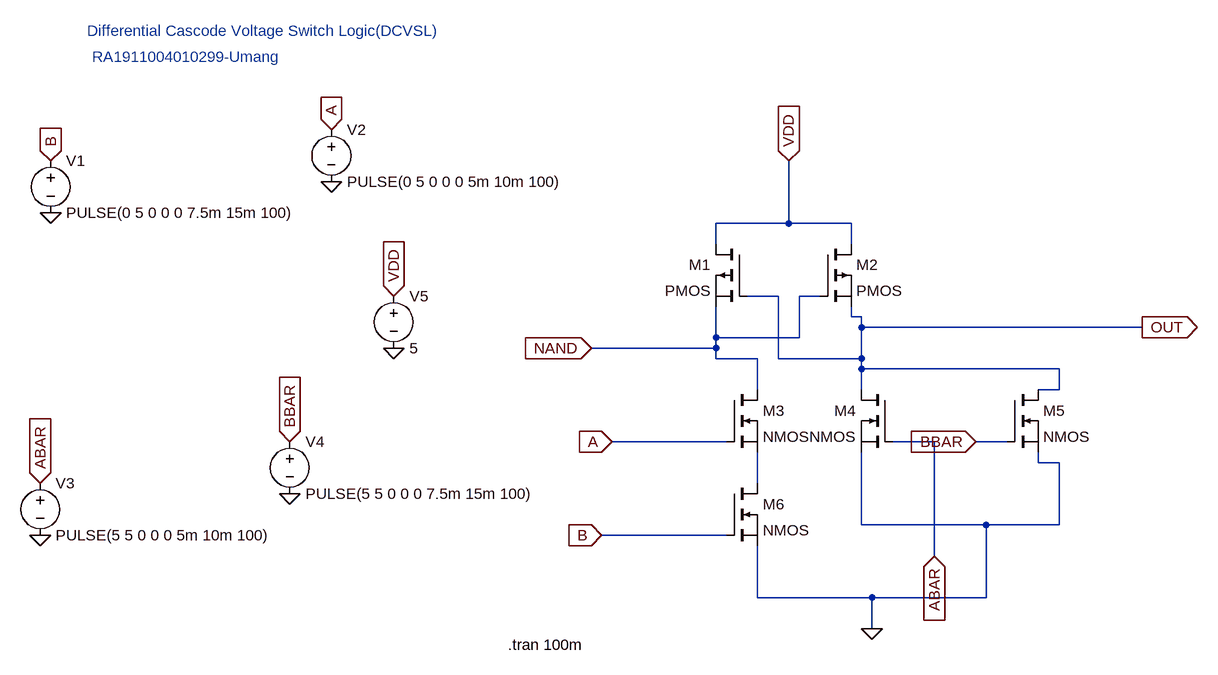
[diagram p0: schematic dcvsl.asc]
dcvsl.asc, the LTspice schematic file:
Version 4
SHEET 1 880 680
WIRE 176 -64 176 -160
WIRE 176 -64 64 -64
WIRE 272 -64 176 -64
WIRE 64 -32 64 -64
WIRE 272 -32 272 -64
WIRE 160 48 112 48
WIRE 224 48 192 48
WIRE 272 80 272 64
WIRE 288 80 272 80
WIRE 288 96 288 80
WIRE 720 96 288 96
WIRE 64 112 64 64
WIRE 192 112 192 48
WIRE 192 112 64 112
WIRE 64 128 64 112
WIRE 64 128 -128 128
WIRE 64 144 64 128
WIRE 128 144 64 144
WIRE 160 144 160 48
WIRE 288 144 288 96
WIRE 288 144 160 144
WIRE 288 160 288 144
WIRE 592 160 288 160
WIRE 128 192 128 144
WIRE 288 192 288 160
WIRE 592 192 592 160
WIRE 592 192 560 192
WIRE 80 272 -96 272
WIRE 400 272 336 272
WIRE 512 272 464 272
WIRE 560 304 560 288
WIRE 592 304 560 304
WIRE 128 336 128 288
WIRE 288 400 288 288
WIRE 480 400 288 400
WIRE 592 400 592 304
WIRE 592 400 480 400
WIRE 80 416 -112 416
WIRE 400 448 400 272
WIRE 128 512 128 432
WIRE 304 512 128 512
WIRE 480 512 480 400
WIRE 480 512 304 512
WIRE 304 560 304 512
FLAG 400 448 ABAR
IOPIN 400 448 In
FLAG 464 272 BBAR
IOPIN 464 272 In
FLAG 720 96 OUT
IOPIN 720 96 Out
FLAG 176 -160 VDD
IOPIN 176 -160 In
FLAG -128 128 NAND
IOPIN -128 128 In
FLAG -96 272 A
IOPIN -96 272 In
FLAG -112 416 B
IOPIN -112 416 In
FLAG 304 560 0
FLAG -960 -160 B
IOPIN -960 -160 In
FLAG -528 -208 A
IOPIN -528 -208 In
FLAG -432 48 VDD
IOPIN -432 48 In
FLAG -592 272 BBAR
IOPIN -592 272 In
FLAG -976 336 ABAR
IOPIN -976 336 In
FLAG -960 -80 0
FLAG -528 -128 0
FLAG -432 128 0
FLAG -592 352 0
FLAG -976 416 0
SYMBOL pmos 112 -32 M0
SYMATTR InstName M1
SYMBOL pmos 224 -32 R0
SYMATTR InstName M2
SYMBOL nmos 80 192 R0
SYMATTR InstName M3
SYMBOL nmos 336 192 M0
SYMATTR InstName M4
SYMBOL nmos 512 192 R0
SYMATTR InstName M5
SYMBOL nmos 80 336 R0
SYMATTR InstName M6
SYMBOL voltage -960 -176 R0
WINDOW 123 0 0 Left 0
WINDOW 39 0 0 Left 0
SYMATTR InstName V1
SYMATTR Value PULSE(0 5 0 0 0 7.5m 15m 100)
SYMBOL voltage -528 -224 R0
WINDOW 123 0 0 Left 0
WINDOW 39 0 0 Left 0
SYMATTR InstName V2
SYMATTR Value PULSE(0 5 0 0 0 5m 10m 100)
SYMBOL voltage -976 320 R0
WINDOW 123 0 0 Left 0
WINDOW 39 0 0 Left 0
SYMATTR InstName V3
SYMATTR Value PULSE(5 5 0 0 0 5m 10m 100)
SYMBOL voltage -592 256 R0
WINDOW 123 0 0 Left 0
WINDOW 39 0 0 Left 0
SYMATTR InstName V4
SYMATTR Value PULSE(5 5 0 0 0 7.5m 15m 100)
SYMBOL voltage -432 32 R0
WINDOW 123 0 0 Left 0
WINDOW 39 0 0 Left 0
SYMATTR InstName V5
SYMATTR Value 5
TEXT -256 584 Left 2 !.tran 100m
TEXT -904 -360 Left 2 ;Differential Cascode Voltage Switch Logic(DCVSL)
TEXT -896 -320 Left 2 ;RA1911004010299-Umang

The netlist it stands for:
* dcvsl.asc
M1 VDD OUT NAND NAND PMOS
M2 VDD NAND OUT OUT PMOS
M3 NAND A N001 N001 NMOS
M4 OUT ABAR 0 0 NMOS
M5 OUT BBAR 0 0 NMOS
M6 N001 B 0 0 NMOS
V1 B 0 PULSE(0 5 0 0 0 7.5m 15m 100)
V2 A 0 PULSE(0 5 0 0 0 5m 10m 100)
V3 ABAR 0 PULSE(5 5 0 0 0 5m 10m 100)
V4 BBAR 0 PULSE(5 5 0 0 0 7.5m 15m 100)
V5 VDD 0 5
.model NMOS NMOS
.model PMOS PMOS
.lib standard.mos
.tran 100m
* Differential Cascode Voltage Switch Logic(DCVSL)
* RA1911004010299-Umang
.backanno
.end